# Altium schematic sheet IMX7S_CPU_INTERFACES_1.SchDoc
size A2
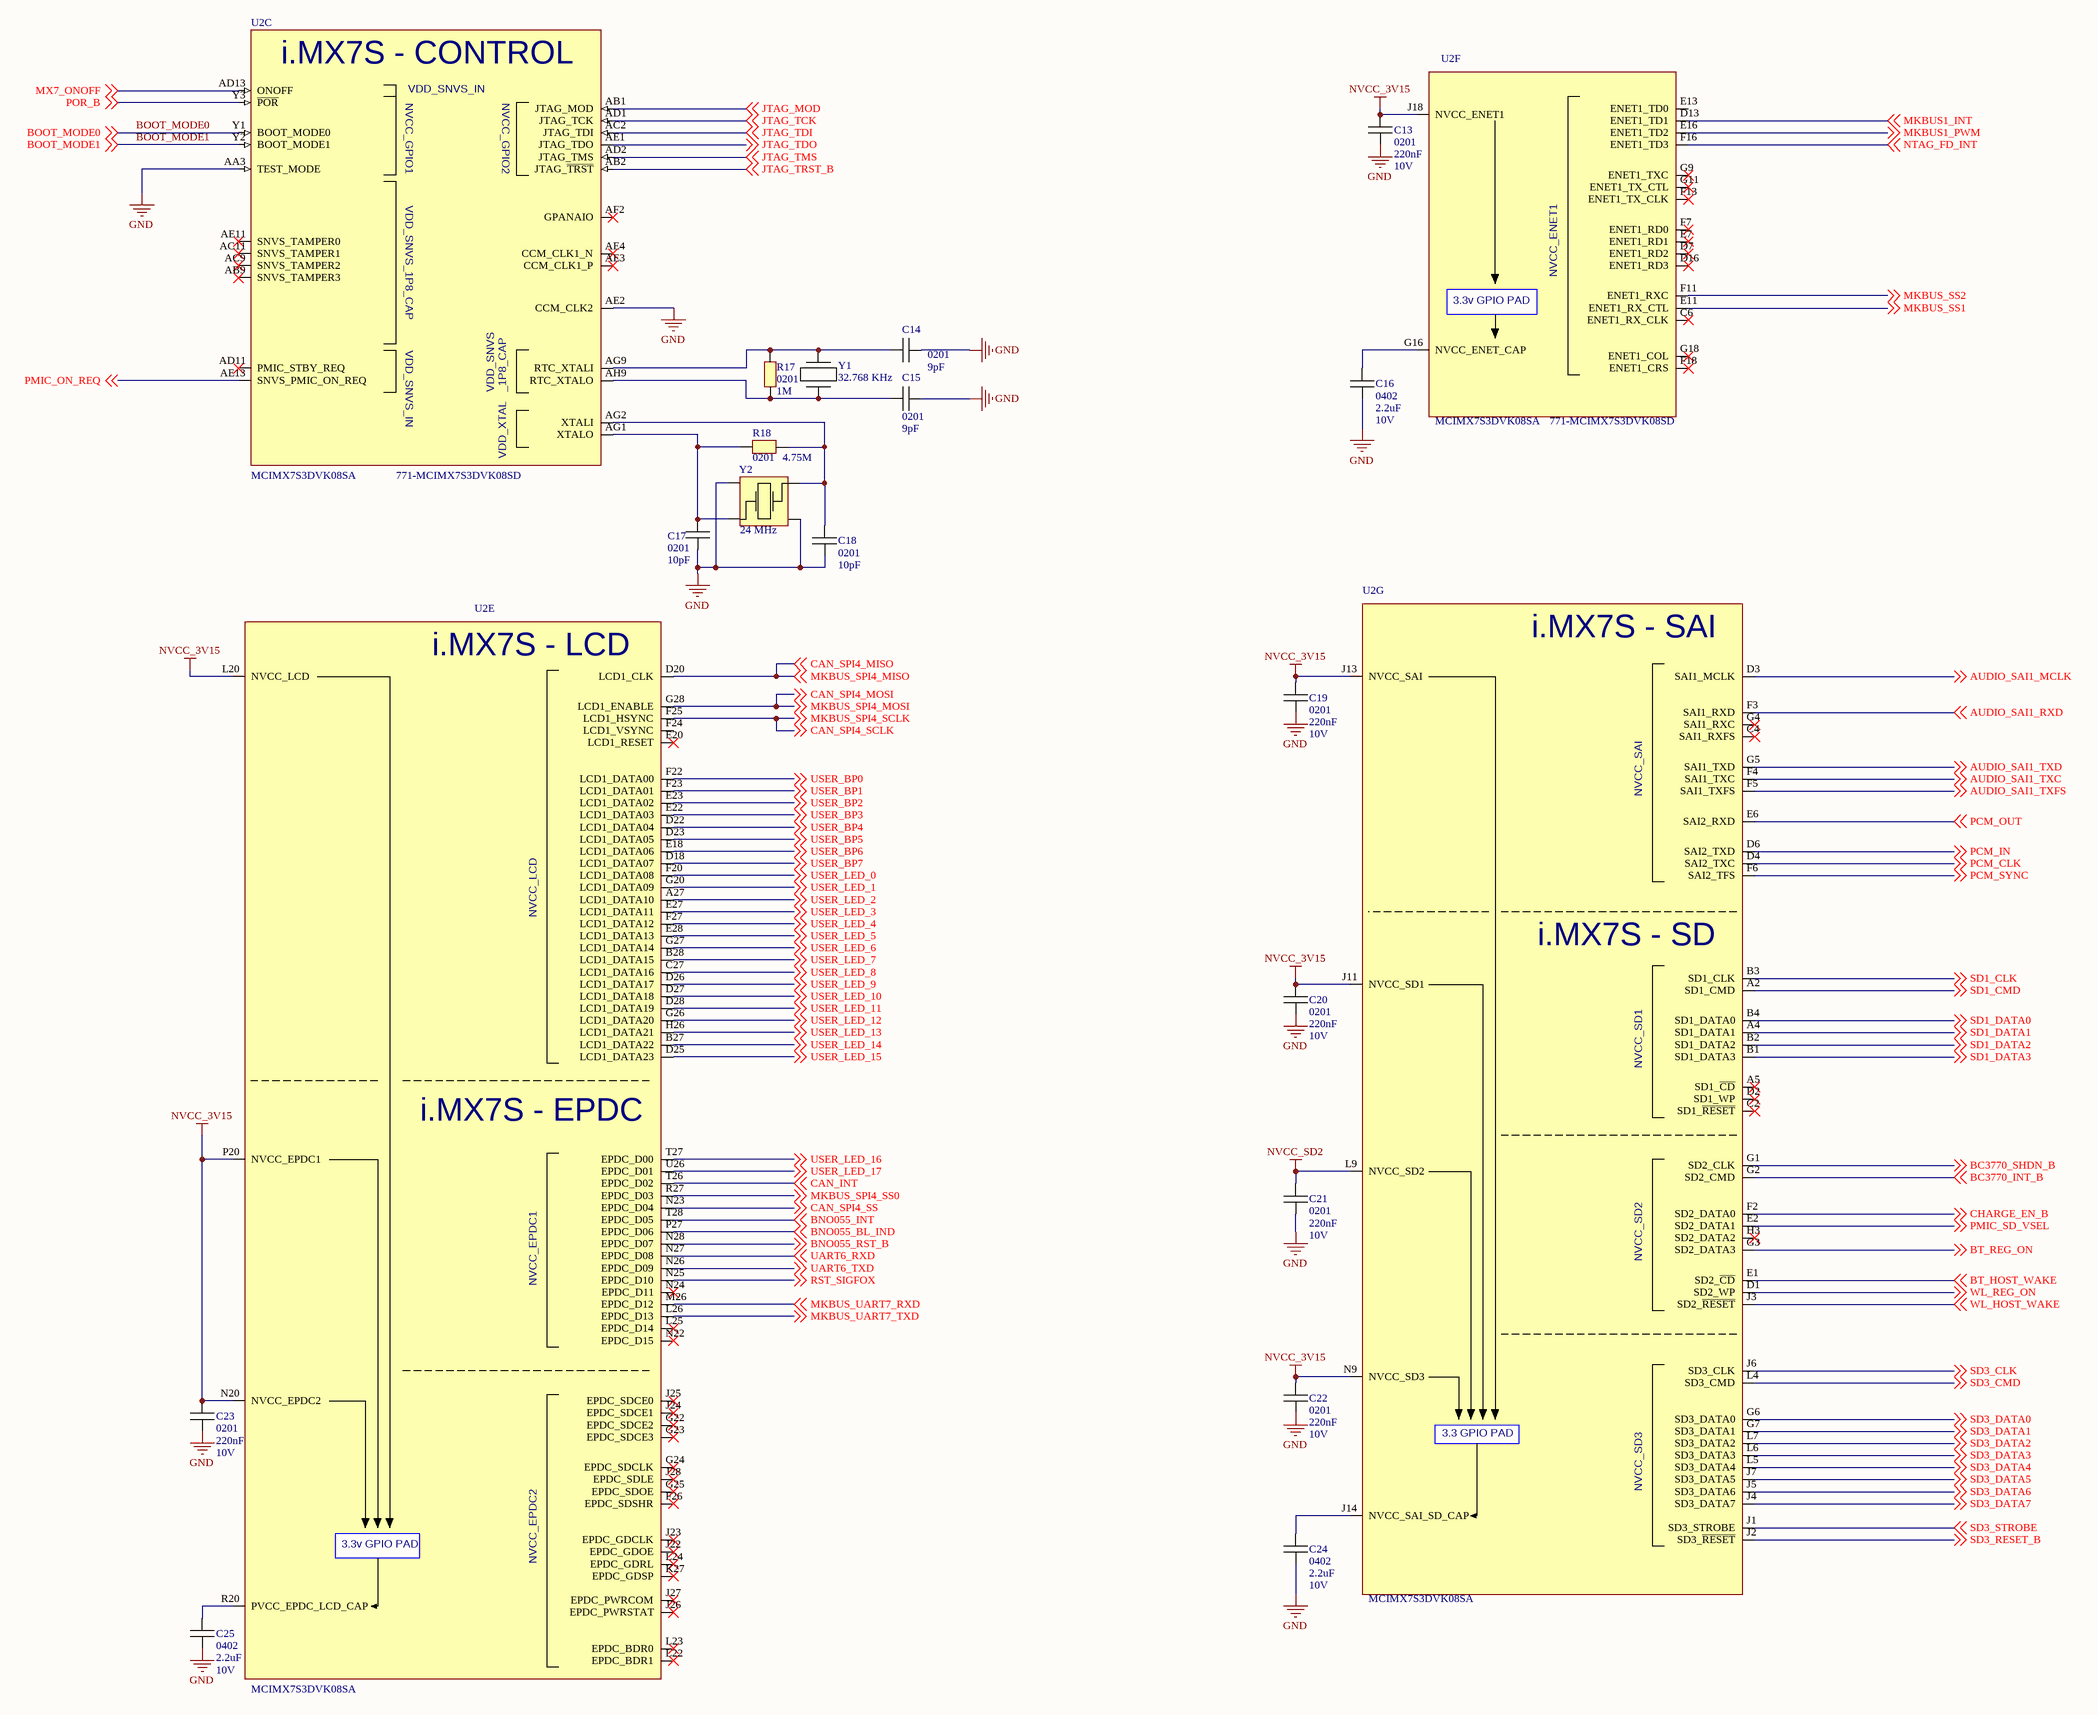
[diagram p0: IMX7S_CPU_INTERFACES_1.SchDoc]

## Parts
C13  value 220nF  PACKAGE: 0201  VOLTAGE: 10V  [C0201]  (hidden comment: C0201)
C14  value 9pF  PACKAGE: 0201  [C0201]  (hidden comment: C0201)
C15  value 9pF  PACKAGE: 0201  [C0201]  (hidden comment: C0201)
C16  value 2.2uF  PACKAGE: 0402  VOLTAGE: 10V  [C0402]  (hidden comment: C0402)
C17  value 10pF  PACKAGE: 0201  [C0201]  (hidden comment: C0201)
C18  value 10pF  PACKAGE: 0201  [C0201]  (hidden comment: C0201)
C19  value 220nF  PACKAGE: 0201  VOLTAGE: 10V  [C0201]  (hidden comment: C0201)
C20  value 220nF  PACKAGE: 0201  VOLTAGE: 10V  [C0201]  (hidden comment: C0201)
C21  value 220nF  PACKAGE: 0201  VOLTAGE: 10V  [C0201]  (hidden comment: C0201)
C22  value 220nF  PACKAGE: 0201  VOLTAGE: 10V  [C0201]  (hidden comment: C0201)
C23  value 220nF  PACKAGE: 0201  VOLTAGE: 10V  [C0201]  (hidden comment: C0201)
C24  value 2.2uF  PACKAGE: 0402  VOLTAGE: 10V  [C0402]  (hidden comment: C0402)
C25  value 2.2uF  PACKAGE: 0402  VOLTAGE: 10V  [C0402]  (hidden comment: C0402)
R17  value 1M  PACKAGE: 0201  [R0201]  (hidden comment: R0201)
R18  value 4.75M  PACKAGE: 0201  [R0201]  (hidden comment: R0201)
U2  MCIMX7S3DVK08SA  Supplier Part Number 1: 771-MCIMX7S3DVK08SD  [BGA 488 PIN]  (parts C,E,F,G of 13)
Y1  32.768 KHz  [ABS07]
Y2  24 MHz  [3225 Crystal]

## Nets
GND: C13.1 C14.1 C15.1 C16.1 C17.1 C18.1 C19.1 C20.1 C21.1 C22.1 C23.1 C24.1 C25.1 U2.AA3(TEST_MODE) U2.AE2(CCM_CLK2) Y2.1 Y2.3
NVCC_3V15: C13.2 C19.2 C20.2 C22.2 C23.2 U2.J11(NVCC_SD1) U2.J13(NVCC_SAI) U2.J18(NVCC_ENET1) U2.L20(NVCC_LCD) U2.N9(NVCC_SD3) U2.N20(NVCC_EPDC2) U2.P20(NVCC_EPDC1)
NVCC_SD2: C21.2 U2.L9(NVCC_SD2)
AUDIO_SAI1_MCLK: U2.D3(SAI1_MCLK) ; off-sheet AUDIO_SAI1_MCLK
AUDIO_SAI1_RXD: U2.F3(SAI1_RXD) ; off-sheet AUDIO_SAI1_RXD
AUDIO_SAI1_TXC: U2.F4(SAI1_TXC) ; off-sheet AUDIO_SAI1_TXC
AUDIO_SAI1_TXD: U2.G5(SAI1_TXD) ; off-sheet AUDIO_SAI1_TXD
AUDIO_SAI1_TXFS: U2.F5(SAI1_TXFS) ; off-sheet AUDIO_SAI1_TXFS
BC3770_INT_B: U2.G2(SD2_CMD) ; off-sheet BC3770_INT_B
BC3770_SHDN_B: U2.G1(SD2_CLK) ; off-sheet BC3770_SHDN_B
BNO055_BL_IND: U2.P27(EPDC_D06) ; off-sheet BNO055_BL_IND
BNO055_INT: U2.T28(EPDC_D05) ; off-sheet BNO055_INT
BNO055_RST_B: U2.N28(EPDC_D07) ; off-sheet BNO055_RST_B
BOOT_MODE0: U2.Y1(BOOT_MODE0) ; off-sheet BOOT_MODE0
BOOT_MODE1: U2.Y2(BOOT_MODE1) ; off-sheet BOOT_MODE1
BT_HOST_WAKE: U2.E1(SD2_~{CD}) ; off-sheet BT_HOST_WAKE
BT_REG_ON: U2.G3(SD2_DATA3) ; off-sheet BT_REG_ON
CAN_INT: U2.T26(EPDC_D02) ; off-sheet CAN_INT
CAN_SPI4_MISO: U2.D20(LCD1_CLK) ; off-sheet MKBUS_SPI4_MISO, off-sheet CAN_SPI4_MISO  [also labelled MKBUS_SPI4_MISO]
CAN_SPI4_MOSI: U2.G28(LCD1_ENABLE) ; off-sheet MKBUS_SPI4_MOSI, off-sheet CAN_SPI4_MOSI  [also labelled MKBUS_SPI4_MOSI]
CAN_SPI4_SCLK: U2.F25(LCD1_HSYNC) ; off-sheet MKBUS_SPI4_SCLK, off-sheet CAN_SPI4_SCLK  [also labelled MKBUS_SPI4_SCLK]
CAN_SPI4_SS: U2.N23(EPDC_D04) ; off-sheet CAN_SPI4_SS
CHARGE_EN_B: U2.F2(SD2_DATA0) ; off-sheet CHARGE_EN_B
JTAG_MOD: U2.AB1(JTAG_MOD) ; off-sheet JTAG_MOD
JTAG_TCK: U2.AD1(JTAG_TCK) ; off-sheet JTAG_TCK
JTAG_TDI: U2.AC2(JTAG_TDI) ; off-sheet JTAG_TDI
JTAG_TDO: U2.AE1(JTAG_TDO) ; off-sheet JTAG_TDO
JTAG_TMS: U2.AD2(JTAG_TMS) ; off-sheet JTAG_TMS
JTAG_TRST_B: U2.AB2(JTAG_~{TRST}) ; off-sheet JTAG_TRST_B
MKBUS1_INT: U2.D13(ENET1_TD1) ; off-sheet MKBUS1_INT
MKBUS1_PWM: U2.E16(ENET1_TD2) ; off-sheet MKBUS1_PWM
MKBUS_SPI4_SS0: U2.R27(EPDC_D03) ; off-sheet MKBUS_SPI4_SS0
MKBUS_SS1: U2.E11(ENET1_RX_CTL) ; off-sheet MKBUS_SS1
MKBUS_SS2: U2.F11(ENET1_RXC) ; off-sheet MKBUS_SS2
MKBUS_UART7_RXD: U2.M26(EPDC_D12) ; off-sheet MKBUS_UART7_RXD
MKBUS_UART7_TXD: U2.L26(EPDC_D13) ; off-sheet MKBUS_UART7_TXD
MX7_ONOFF: U2.AD13(ONOFF) ; off-sheet MX7_ONOFF
NTAG_FD_INT: U2.F16(ENET1_TD3) ; off-sheet NTAG_FD_INT
PCM_CLK: U2.D4(SAI2_TXC) ; off-sheet PCM_CLK
PCM_IN: U2.D6(SAI2_TXD) ; off-sheet PCM_IN
PCM_OUT: U2.E6(SAI2_RXD) ; off-sheet PCM_OUT
PCM_SYNC: U2.F6(SAI2_TFS) ; off-sheet PCM_SYNC
PMIC_ON_REQ: U2.AE13(SNVS_PMIC_ON_REQ) ; off-sheet PMIC_ON_REQ
PMIC_SD_VSEL: U2.E2(SD2_DATA1) ; off-sheet PMIC_SD_VSEL
POR_B: U2.Y3(~{POR}) ; off-sheet POR_B
RST_SIGFOX: U2.N25(EPDC_D10) ; off-sheet RST_SIGFOX
SD1_CLK: U2.B3(SD1_CLK) ; off-sheet SD1_CLK
SD1_CMD: U2.A2(SD1_CMD) ; off-sheet SD1_CMD
SD1_DATA0: U2.B4(SD1_DATA0) ; off-sheet SD1_DATA0
SD1_DATA1: U2.A4(SD1_DATA1) ; off-sheet SD1_DATA1
SD1_DATA2: U2.B2(SD1_DATA2) ; off-sheet SD1_DATA2
SD1_DATA3: U2.B1(SD1_DATA3) ; off-sheet SD1_DATA3
SD3_CLK: U2.J6(SD3_CLK) ; off-sheet SD3_CLK
SD3_CMD: U2.L4(SD3_CMD) ; off-sheet SD3_CMD
SD3_DATA0: U2.G6(SD3_DATA0) ; off-sheet SD3_DATA0
SD3_DATA1: U2.G7(SD3_DATA1) ; off-sheet SD3_DATA1
SD3_DATA2: U2.L7(SD3_DATA2) ; off-sheet SD3_DATA2
SD3_DATA3: U2.L6(SD3_DATA3) ; off-sheet SD3_DATA3
SD3_DATA4: U2.L5(SD3_DATA4) ; off-sheet SD3_DATA4
SD3_DATA5: U2.J7(SD3_DATA5) ; off-sheet SD3_DATA5
SD3_DATA6: U2.J5(SD3_DATA6) ; off-sheet SD3_DATA6
SD3_DATA7: U2.J4(SD3_DATA7) ; off-sheet SD3_DATA7
SD3_RESET_B: U2.J2(SD3_~{RESET}) ; off-sheet SD3_RESET_B
SD3_STROBE: U2.J1(SD3_STROBE) ; off-sheet SD3_STROBE
UART6_RXD: U2.N27(EPDC_D08) ; off-sheet UART6_RXD
UART6_TXD: U2.N26(EPDC_D09) ; off-sheet UART6_TXD
USER_BP0: U2.F22(LCD1_DATA00) ; off-sheet USER_BP0
USER_BP1: U2.F23(LCD1_DATA01) ; off-sheet USER_BP1
USER_BP2: U2.E23(LCD1_DATA02) ; off-sheet USER_BP2
USER_BP3: U2.E22(LCD1_DATA03) ; off-sheet USER_BP3
USER_BP4: U2.D22(LCD1_DATA04) ; off-sheet USER_BP4
USER_BP5: U2.D23(LCD1_DATA05) ; off-sheet USER_BP5
USER_BP6: U2.E18(LCD1_DATA06) ; off-sheet USER_BP6
USER_BP7: U2.D18(LCD1_DATA07) ; off-sheet USER_BP7
USER_LED_0: U2.F20(LCD1_DATA08) ; off-sheet USER_LED_0
USER_LED_1: U2.G20(LCD1_DATA09) ; off-sheet USER_LED_1
USER_LED_2: U2.A27(LCD1_DATA10) ; off-sheet USER_LED_2
USER_LED_3: U2.E27(LCD1_DATA11) ; off-sheet USER_LED_3
USER_LED_4: U2.F27(LCD1_DATA12) ; off-sheet USER_LED_4
USER_LED_5: U2.E28(LCD1_DATA13) ; off-sheet USER_LED_5
USER_LED_6: U2.G27(LCD1_DATA14) ; off-sheet USER_LED_6
USER_LED_7: U2.B28(LCD1_DATA15) ; off-sheet USER_LED_7
USER_LED_8: U2.C27(LCD1_DATA16) ; off-sheet USER_LED_8
USER_LED_9: U2.D26(LCD1_DATA17) ; off-sheet USER_LED_9
USER_LED_10: U2.D27(LCD1_DATA18) ; off-sheet USER_LED_10
USER_LED_11: U2.D28(LCD1_DATA19) ; off-sheet USER_LED_11
USER_LED_12: U2.G26(LCD1_DATA20) ; off-sheet USER_LED_12
USER_LED_13: U2.H26(LCD1_DATA21) ; off-sheet USER_LED_13
USER_LED_14: U2.B27(LCD1_DATA22) ; off-sheet USER_LED_14
USER_LED_15: U2.D25(LCD1_DATA23) ; off-sheet USER_LED_15
USER_LED_16: U2.T27(EPDC_D00) ; off-sheet USER_LED_16
USER_LED_17: U2.U26(EPDC_D01) ; off-sheet USER_LED_17
WL_HOST_WAKE: U2.J3(SD2_~{RESET}) ; off-sheet WL_HOST_WAKE
WL_REG_ON: U2.D1(SD2_WP) ; off-sheet WL_REG_ON
NetC14_2: C14.2 R17.2 U2.AG9(RTC_XTALI) Y1.2
NetC15_2: C15.2 R17.1 U2.AH9(RTC_XTALO) Y1.1
NetC16_2: C16.2 U2.G16(NVCC_ENET_CAP)
NetC17_2: C17.2 R18.2 U2.AG1(XTALO) Y2.2
NetC18_2: C18.2 R18.1 U2.AG2(XTALI) Y2.4
NetC24_2: C24.2 U2.J14(NVCC_SAI_SD_CAP)
NetC25_2: C25.2 U2.R20(PVCC_EPDC_LCD_CAP)

Not connected (* = marked no-connect by the designer): U2 A5(SD1_~{CD})* AB9(SNVS_TAMPER3)* AC9(SNVS_TAMPER2)* AC11(SNVS_TAMPER1)* AD11(PMIC_STBY_REQ)* AE3(CCM_CLK1_P)* AE4(CCM_CLK1_N)* AE11(SNVS_TAMPER0)* AF2(GPANAIO)* C2(SD1_~{RESET})* C4(SAI1_RXFS)* C6(ENET1_RX_CLK)* D2(SD1_WP)* D7(ENET1_RD2)* D16(ENET1_RD3)* E7(ENET1_RD1)* E13(ENET1_TD0) E20(LCD1_RESET)* F7(ENET1_RD0)* F13(ENET1_TX_CLK)* F18(ENET1_CRS)* F24(LCD1_VSYNC) F26(EPDC_SDSHR)* G4(SAI1_RXC)* G9(ENET1_TXC)* G11(ENET1_TX_CTL)* G18(ENET1_COL)* G22(EPDC_SDCE2)* G23(EPDC_SDCE3)* G24(EPDC_SDCLK)* G25(EPDC_SDOE)* H3(SD2_DATA2)* J22(EPDC_GDOE)* J23(EPDC_GDCLK)* J24(EPDC_SDCE1)* J25(EPDC_SDCE0)* J26(EPDC_PWRSTAT)* J27(EPDC_PWRCOM)* J28(EPDC_SDLE)* K27(EPDC_GDSP)* L22(EPDC_BDR1)* L23(EPDC_BDR0)* L24(EPDC_GDRL)* L25(EPDC_D14)* N22(EPDC_D15)* N24(EPDC_D11)*

## Notes on the sheet
- Title
- Size:
- Date:
- File:
- A2
- Number:
- Time:
- Revision:
- Sheet
- of
- (in symbol MCIMX7S3DVK08SD, part C) i.MX7S - CONTROL; VDD_SNVS; _1P8_CAP; VDD_XTAL
- (in symbol MCIMX7S3DVK08SD, part E) i.MX7S - LCD; i.MX7S - EPDC; 3.3v GPIO PAD
- (in symbol MCIMX7S3DVK08SD, part F) 3.3v GPIO PAD
- (in symbol MCIMX7S3DVK08SD, part G) i.MX7S - SAI; i.MX7S - SD; 3.3 GPIO PAD

## Library data of the parts
C13 C19-C23 = C0201: Manufacturer 1: Murata; Manufacturer Part Number 1: GRM033R61A224KE90D; Tolerance: 10%; Dielectric: X5R; Supplier 1: Farnell; Supplier Part Number 1: 2990687; Stock 1: 4290; Pricing 1: 10=0,04270, 100=0,02370, 500=0,01800, 2500=0,01350, 7500=0,00950, 15000=0,00760, 75000=0,00630 (EUR); RoHS: Yes; Mount: Surface Mount; Case/Package: 0201; Case Code (Metric): 0603; Case Code (Imperial): 0201; Min Operating Temperature: -55°C; Max Operating Temperature: 85°C; Capacitance: 220nF; Voltage Rating (DC): 10V; Packaging: Tape and Reel; Voltage Rating: 10V; Length: 0.024inch; Width: 0.012inch; Thickness: 0.013inch; ComponentLink1URL: http://www.mouser.com/ds/2/281/c02e-2905.pdf?src-supplier=Mouser; ComponentLink1Description: http://www.mouser.com/ds/2/281/c02e-2905.pdf?src-supplier=Mouser; ComponentLink2URL: http://search.murata.co.jp/Ceramy/image/img/A01X/G101/ENG/GRM033R61A224KE90-01.pdf?src-supplier=Digi-Key; ComponentLink2Description: http://search.murata.co.jp/Ceramy/image/img/A01X/G101/ENG/GRM033R61A224KE90-01.pdf?src-supplier=Digi-Key
C14 C15 = C0201: Manufacturer 1: TDK; Manufacturer Part Number 1: CGA1A2C0G1E090D030BA; VOLTAGE: 0V; Description: CAP CER 9PF 25V C0G 0201; Voltage Rating: 25V; Dielectric: C0G; Supplier 1: RSComponents; Supplier Part Number 1: 1447034; Stock 1: 15000; Pricing 1: 15000=0,00900 (EUR); RoHS: Yes; Mount: Surface Mount; Case/Package: 0201; Weight: 6E-06oz; Case Code (Metric): 0603; Case Code (Imperial): 0201; Min Operating Temperature: -55°C; Max Operating Temperature: 125°C; Package Quantity: 1; Packaging: Tape and Reel; Capacitance: 9pF; Voltage Rating (DC): 25V; Termination: SMD/SMT; Composition: Ceramic; Length: 0.024inch; Height: 0.3mm; Width: 0.012inch; Thickness: 0.012inch; Ratings: AEC-Q200; ComponentLink1URL: http://www.mouser.com/ds/2/400/lcc_automotive_general_en-843974.pdf?src-supplier=Mouser; ComponentLink1Description: http://www.mouser.com/ds/2/400/lcc_automotive_general_en-843974.pdf?src-supplier=Mouser; ComponentLink2URL: https://product.tdk.com/info/en/documents/chara_sheet/CGA1A2C0G1E090D030BA.pdf?src-supplier=Digi-Key; ComponentLink2Description: https://product.tdk.com/info/en/documents/chara_sheet/CGA1A2C0G1E090D030BA.pdf?src-supplier=Digi-Key; ComponentLink3URL: https://product.tdk.com/info/en/catalog/datasheets/mlcc_automotive_general_en.pdf?src-supplier=Digi-Key; ComponentLink3Description: https://product.tdk.com/info/en/catalog/datasheets/mlcc_automotive_general_en.pdf?src-supplier=Digi-Key; ComponentLink4URL: http://product.tdk.com/capacitor/mlcc/en/documents/mlcc_automotive_general_en.pdf?src-supplier=Avnet; ComponentLink4Description: http://product.tdk.com/capacitor/mlcc/en/documents/mlcc_automotive_general_en.pdf?src-supplier=Avnet
C16 C24 C25 = C0402: Manufacturer 1: Wurth Electronics; Manufacturer Part Number 1: 885012105013; Tolerance: 20%; Supplier 1: Farnell; Supplier Part Number 1: 2533930; Stock 1: 11802; Pricing 1: 10=0,21600, 100=0,14100, 500=0,10600, 2500=0,09320, 5000=0,07880, 10000=0,07420, 50000=0,06950 (EUR); RoHS: Yes; Mount: Surface Mount; Case/Package: 0402; Case Code (Metric): 1005; Case Code (Imperial): 0402; Min Operating Temperature: -55°C; Max Operating Temperature: 85°C; Packaging: Tape and Reel; Capacitance: 2.2uF; Voltage Rating: 10V; Length: 0.039inch; Width: 0.02inch; Thickness: 0.022inch; ComponentLink1URL: http://www.farnell.com/datasheets/2031748.pdf?src-supplier=Farnell; ComponentLink1Description: http://www.farnell.com/datasheets/2031748.pdf?src-supplier=Farnell; ComponentLink2URL: https://katalog.we-online.de/pbs/datasheet/885012105013.pdf?src-supplier=Digi-Key; ComponentLink2Description: https://katalog.we-online.de/pbs/datasheet/885012105013.pdf?src-supplier=Digi-Key
C17 C18 = C0201: Manufacturer 1: Murata; Manufacturer Part Number 1: GRM0335C1H180GA01D; VOLTAGE: 0V; Description: 0201 18 pF 50 V ±2% Tolerance C0G/NP0 Multilayer Ceramic Capacitor; Voltage Rating: 50V; Capacitance: 18pF; Tolerance: 2%; Supplier 1: Farnell; Supplier Part Number 1: 2990623; Stock 1: 11590; Pricing 1: 10=0,02610, 100=0,01320, 500=0,00970, 2500=0,00770, 7500=0,00570, 15000=0,00460, 75000=0,00310 (EUR); RoHS: Yes; Mount: Surface Mount; Case/Package: 0201; Case Code (Metric): 0603; Case Code (Imperial): 0201; Min Operating Temperature: -55°C; Max Operating Temperature: 125°C; Package Quantity: 15000; Packaging: Tape and Reel; Termination: SMD/SMT; Voltage Rating (DC): 50V; Length: 0.024inch; Width: 0.012inch; Thickness: 0.013inch; ComponentLink1URL: http://www.mouser.com/ds/2/281/c02e-2905.pdf?src-supplier=Mouser; ComponentLink1Description: http://www.mouser.com/ds/2/281/c02e-2905.pdf?src-supplier=Mouser; ComponentLink2URL: http://search.murata.co.jp/Ceramy/image/img/A01X/partnumbering_e_01.pdf?src-supplier=Digi-Key; ComponentLink2Description: http://search.murata.co.jp/Ceramy/image/img/A01X/partnumbering_e_01.pdf?src-supplier=Digi-Key; ComponentLink3URL: http://search.murata.co.jp/Ceramy/image/img/A01X/G101/ENG/GRM0335C1H180GA01-01.pdf?src-supplier=Digi-Key; ComponentLink3Description: http://search.murata.co.jp/Ceramy/image/img/A01X/G101/ENG/GRM0335C1H180GA01-01.pdf?src-supplier=Digi-Key
R17 = R0201: Manufacturer 1: Multicomp; Manufacturer Part Number 1: MCRE000212; VOLTAGE: 0V; Description: MULTICOMP   MCRE000212   Surface Mount Chip Resistor, Thick Film, MCRE Series, 1 Mohm, 50 mW,  1%, 25 V, 0201 [0603 Metric]; Resistance: 1MR; Power Rating: 50mW; Tolerance: 1%; Voltage Rating: 25V; Temperature Coefficient: 200ppm/°C; Supplier 1: Farnell; Supplier Part Number 1: 1711695; Stock 1: 21808; Pricing 1: 10=0,01700, 100=0,01020, 500=0,00730, 2500=0,00570, 7500=0,00460 (EUR); RoHS: Yes; Case/Package: SMD/SMT; Case Code (Metric): 0603; Case Code (Imperial): 0201; Min Operating Temperature: -55°C; Max Operating Temperature: 125°C; Packaging: Cut Tape; Composition: Thick Film; Voltage Rating (DC): 25V; Width: 0.6mm; REACH SVHC: No SVHC; ComponentLink1URL: https://datasheet.ciiva.com/7919/1729044-7919021.pdf?src-supplier=Element14; ComponentLink1Description: https://datasheet.ciiva.com/7919/1729044-7919021.pdf?src-supplier=Element14; ComponentLink2URL: https://datasheet.ciiva.com/7919/1729044-7919022.pdf?src-supplier=Element14; ComponentLink2Description: https://datasheet.ciiva.com/7919/1729044-7919022.pdf?src-supplier=Element14; ComponentLink3URL: https://datasheet.ciiva.com/22689/1729044-22689531.pdf?src-supplier=Element14; ComponentLink3Description: https://datasheet.ciiva.com/22689/1729044-22689531.pdf?src-supplier=Element14
R18 = R0201: Manufacturer 1: Multicomp; Manufacturer Part Number 1: MC0201L6J4704SE; VOLTAGE: 0V; Description: MULTICOMP - MC0201L6J4704SE - RES, 4M7, 5%, 0.05W, 0201, THICK FILM; Resistance: 4.7MR; Tolerance: 5%; Temperature Coefficient: 200ppm/°C; Power Rating: 50mW; Voltage Rating: 25V; Supplier 1: Farnell; Supplier Part Number 1: 1851499; Stock 1: 16622; Pricing 1: 10=0,00930, 100=0,00720, 500=0,00640, 2500=0,00440, 5000=0,00380, 10000=0,00330, 50000=0,00240, 100000=0,00230 (EUR); RoHS: Yes; Case/Package: 0201; Number of Pins: 2; Case Code (Metric): 0603; Case Code (Imperial): 0201; Packaging: Cut Tape; Composition: Thick Film; Voltage Rating (DC): 25V; REACH SVHC: Unknown; ComponentLink1URL: http://www.farnell.com/datasheets/1719193.pdf?src-supplier=Farnell; ComponentLink1Description: http://www.farnell.com/datasheets/1719193.pdf?src-supplier=Farnell; ComponentLink2URL: http://www.farnell.com/datasheets/1719193.pdf?src-supplier=Element14; ComponentLink2Description: http://www.farnell.com/datasheets/1719193.pdf?src-supplier=Element14
U2 = MCIMX7S3DVK08SD: Supplier 1: Mouser
Y1 = Quartz 32.768: Supplier 1: Farnell; Supplier Part Number 1: 2819305
Y2 = Quartz 24M: Supplier 1: Farnell; Supplier Part Number 1: 2853961